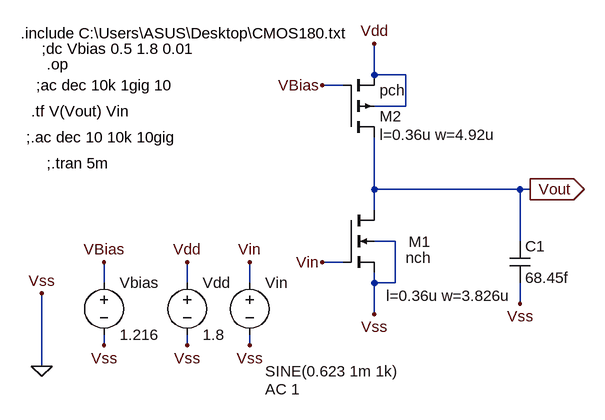
[diagram p0: schematic CS amplifier.asc]
CS amplifier.asc, the LTspice schematic file:
Version 4
SHEET 1 944 680
WIRE 432 -112 432 -160
WIRE 480 -112 432 -112
WIRE 384 -96 352 -96
WIRE 480 -64 480 -112
WIRE 480 -64 432 -64
WIRE 432 64 432 -16
WIRE 656 64 432 64
WIRE 672 64 656 64
WIRE 432 96 432 64
WIRE 464 144 432 144
WIRE 656 144 656 64
WIRE 384 176 352 176
WIRE 16 208 16 176
WIRE 144 208 144 176
WIRE 240 208 240 176
WIRE 432 208 432 192
WIRE 464 208 464 144
WIRE 464 208 432 208
WIRE 656 240 656 208
WIRE 432 256 432 208
WIRE 16 304 16 288
WIRE 144 304 144 288
WIRE 240 304 240 288
WIRE -80 336 -80 224
FLAG -80 336 0
FLAG -80 224 Vss
FLAG 240 176 Vin
FLAG 144 304 Vss
FLAG 240 304 Vss
FLAG 144 176 Vdd
FLAG 432 -160 Vdd
FLAG 352 176 Vin
FLAG 432 256 Vss
FLAG 672 64 Vout
IOPIN 672 64 Out
FLAG 656 240 Vss
FLAG 16 304 Vss
FLAG 16 176 VBias
FLAG 352 -96 VBias
SYMBOL nmos4 384 96 R0
WINDOW 0 101 49 Left 2
WINDOW 3 96 73 Left 2
WINDOW 123 66 132 Left 2
SYMATTR InstName M1
SYMATTR Value nch
SYMATTR Value2 l=0.36u w=3.826u
SYMBOL voltage 144 192 R0
WINDOW 123 0 0 Left 0
WINDOW 39 0 0 Left 0
SYMATTR InstName Vdd
SYMATTR Value 1.8
SYMBOL voltage 240 192 R0
WINDOW 3 24 152 Left 2
WINDOW 123 24 180 Left 2
WINDOW 39 0 0 Left 0
SYMATTR Value SINE(0.623 1m 1k)
SYMATTR Value2 AC 1
SYMATTR InstName Vin
SYMBOL cap 640 144 R0
SYMATTR InstName C1
SYMATTR Value 68.45f
SYMBOL pmos4 384 -16 M180
WINDOW 123 56 4 Left 2
SYMATTR Value2 l=0.36u w=4.92u
SYMATTR InstName M2
SYMATTR Value pch
SYMBOL voltage 16 192 R0
WINDOW 123 0 0 Left 0
WINDOW 39 0 0 Left 0
SYMATTR InstName Vbias
SYMATTR Value 1.216
TEXT -112 -176 Left 2 !.include C:\\Users\\ASUS\\Desktop\\CMOS180.txt
TEXT -72 -128 Left 2 !.op
TEXT -88 -96 Left 2 !;ac dec 10k 1gig 10
TEXT -96 -56 Left 2 !.tf V(Vout) Vin
TEXT -104 -16 Left 2 !;.ac dec 10 10k 10gig
TEXT -72 24 Left 2 !;.tran 5m
TEXT -80 -152 Left 2 !;dc Vbias 0.5 1.8 0.01

The netlist it stands for:
* CS amplifier.asc
M1 Vout Vin 0 0 nch l=0.36u w=3.826u
Vdd Vdd 0 1.8
Vin Vin 0 SINE(0.623 1m 1k) AC 1
C1 Vout 0 68.45f
M2 Vout VBias Vdd Vdd pch l=0.36u w=4.92u
Vbias VBias 0 1.216
.model NMOS NMOS
.model PMOS PMOS
.lib standard.mos
.include C:\Users\ASUS\Desktop\CMOS180.txt
.op
;ac dec 10k 1gig 10
.tf V(Vout) Vin
;.ac dec 10 10k 10gig
;.tran 5m
;dc Vbias 0.5 1.8 0.01
.backanno
.end